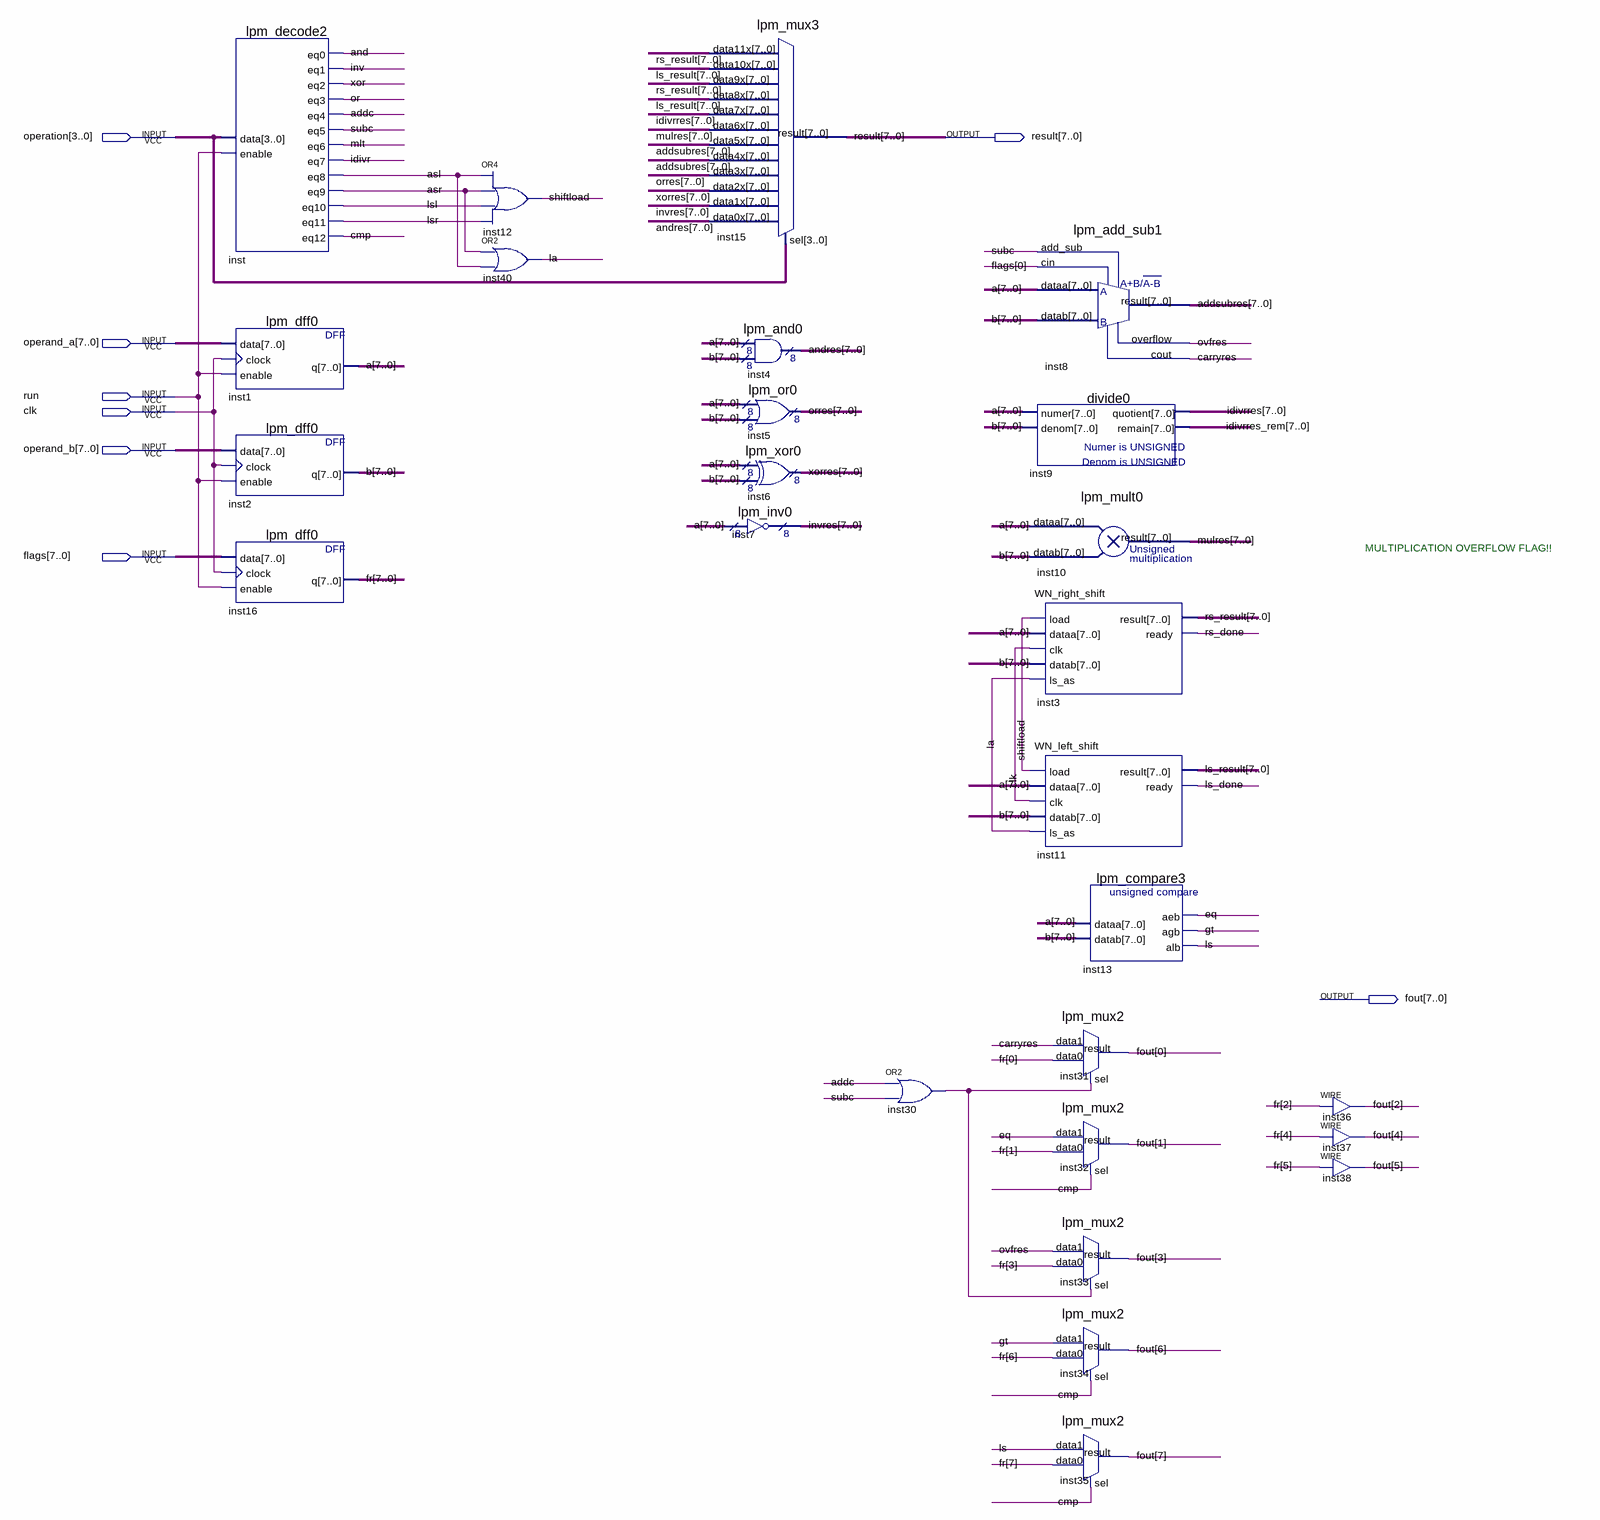
[diagram p0: schematic sheet]
// Quartus schematic WN_ALU.bdf as structural Verilog: 26 symbols, 8 pins
module WN_ALU (
  input  [3:0] operation,
  input  [7:0] operand_a,
  input  run,
  input  clk,
  input  [7:0] operand_b,
  input  [7:0] flags,
  output [7:0] result,
  output [7:0] fout
);

  wire addc, \and , asl, asr, carryres, cmp, eq, gt, idivr, inst30_out, inv, la, ls, ls_done, lsl, lsr, mlt,
       \or , ovfres, rs_done, shiftload, subc, \xor ;
  wire [7:0] a, addsubres, andres, b, fr, idivrres, idivrres_rem, invres, ls_result, mulres, orres,
       rs_result, xorres;

  lpm_decode2 inst (
    .data(operation), .enable(run), .eq0(\and ), .eq1(inv), .eq2(\xor ), .eq3(\or ), .eq4(addc), .eq5(subc),
    .eq6(mlt), .eq7(idivr), .eq8(asl), .eq9(asr), .eq10(lsl), .eq11(lsr), .eq12(cmp));
  lpm_dff0 inst1 (.data(operand_a), .clock(clk), .enable(run), .q(a));
  lpm_dff0 inst2 (.data(operand_b), .clock(clk), .enable(run), .q(b));
  lpm_dff0 inst16 (.data(flags), .clock(clk), .enable(run), .q(fr));
  or inst12 (shiftload, asl, asr, lsl, lsr);
  or inst40 (la, asr, asl);
  lpm_mux3 inst15 (
    .data11x(rs_result), .data10x(ls_result), .data9x(rs_result), .data8x(ls_result), .data7x(idivrres),
    .data6x(mulres), .data5x(addsubres), .data4x(addsubres), .data3x(orres), .data2x(xorres),
    .data1x(invres), .data0x(andres), .sel(operation), .result(result));
  lpm_and0 inst4 (.data0x(a), .data1x(b), .result(andres));
  lpm_or0 inst5 (.data0x(a), .data1x(b), .result(orres));
  lpm_xor0 inst6 (.data0x(a), .data1x(b), .result(xorres));
  lpm_inv0 inst7 (.data(a), .result(invres));
  or inst30 (inst30_out, addc, subc);
  lpm_add_sub1 inst8 (
    .dataa(a), .datab(b), .add_sub(subc), .cin(flags[0]), .result(addsubres), .overflow(ovfres),
    .cout(carryres));
  divide0 inst9 (.numer(a), .denom(b), .quotient(idivrres), .remain(idivrres_rem));
  lpm_mult0 inst10 (.dataa(a), .datab(b), .result(mulres));
  WN_right_shift inst3 (
    .load(shiftload), .dataa(a), .clk(clk), .datab(b), .ls_as(la), .result(rs_result), .ready(rs_done));
  WN_left_shift inst11 (
    .load(shiftload), .dataa(a), .clk(clk), .datab(b), .ls_as(la), .result(ls_result), .ready(ls_done));
  lpm_mux2 inst31 (.data1(carryres), .data0(fr[0]), .sel(inst30_out), .result(fout[0]));
  lpm_mux2 inst32 (.data1(eq), .data0(fr[1]), .sel(cmp), .result(fout[1]));
  lpm_mux2 inst33 (.data1(ovfres), .data0(fr[3]), .sel(inst30_out), .result(fout[3]));
  lpm_mux2 inst34 (.data1(gt), .data0(fr[6]), .sel(cmp), .result(fout[6]));
  lpm_mux2 inst35 (.data1(ls), .data0(fr[7]), .sel(cmp), .result(fout[7]));
  lpm_compare3 inst13 (.dataa(a), .datab(b), .aeb(eq), .agb(gt), .alb(ls));
  assign fout[2] = fr[2];  // WIRE inst36
  assign fout[4] = fr[4];  // WIRE inst37
  assign fout[5] = fr[5];  // WIRE inst38

  // Notes on the sheet:
  //   MULTIPLICATION OVERFLOW FLAG!!
endmodule
